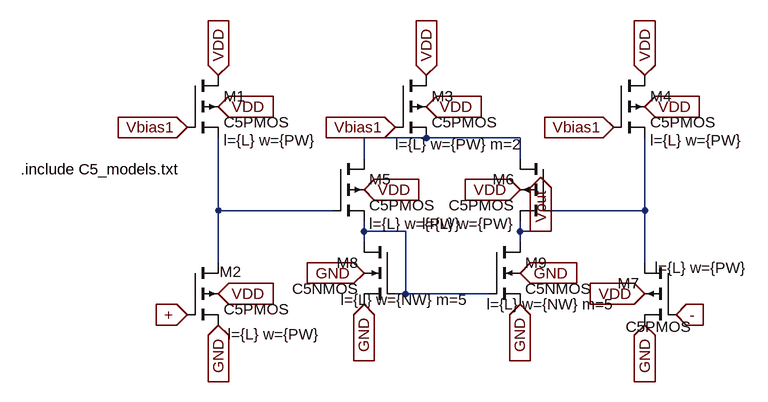
[diagram p0: schematic gainEnhancementPmos.asc]
gainEnhancementPmos.asc, the LTspice schematic file:
Version 4
SHEET 1 880 680
WIRE 304 160 208 160
WIRE 448 160 304 160
WIRE 208 192 208 160
WIRE 448 192 448 160
WIRE -16 272 -16 160
WIRE 160 272 -16 272
WIRE 640 272 640 160
WIRE 640 272 496 272
WIRE 208 304 208 288
WIRE 272 304 208 304
WIRE 448 304 448 288
WIRE 480 304 448 304
WIRE 496 304 480 304
WIRE 208 320 208 304
WIRE 448 320 448 304
WIRE -16 352 -16 272
WIRE 640 352 640 272
WIRE 272 400 272 304
WIRE 272 400 256 400
WIRE 400 400 272 400
FLAG -64 144 Vbias1
IOPIN -64 144 In
FLAG -64 432 +
IOPIN -64 432 In
FLAG 688 432 -
IOPIN 688 432 In
FLAG 480 304 Vout
IOPIN 480 304 Out
FLAG 640 64 VDD
IOPIN 640 64 In
FLAG 640 112 VDD
IOPIN 640 112 In
FLAG 304 112 VDD
IOPIN 304 112 In
FLAG 304 64 VDD
IOPIN 304 64 In
FLAG -16 112 VDD
IOPIN -16 112 In
FLAG -16 64 VDD
IOPIN -16 64 In
FLAG 256 144 Vbias1
IOPIN 256 144 In
FLAG 592 144 Vbias1
IOPIN 592 144 In
FLAG 208 240 VDD
IOPIN 208 240 In
FLAG 448 240 VDD
IOPIN 448 240 In
FLAG -16 448 GND
IOPIN -16 448 In
FLAG 208 416 GND
IOPIN 208 416 In
FLAG 208 368 GND
IOPIN 208 368 In
FLAG 448 416 GND
IOPIN 448 416 In
FLAG 448 368 GND
IOPIN 448 368 In
FLAG 640 448 GND
IOPIN 640 448 In
FLAG -16 400 VDD
IOPIN -16 400 In
FLAG 640 400 VDD
IOPIN 640 400 In
SYMBOL pmos4 -64 64 R0
WINDOW 123 56 100 Left 2
SYMATTR Value2 l={L} w={PW}
SYMATTR InstName M1
SYMATTR Value C5PMOS
SYMBOL pmos4 -64 352 R0
WINDOW 0 50 14 Left 2
WINDOW 123 62 110 Left 2
SYMATTR InstName M2
SYMATTR Value2 l={L} w={PW}
SYMATTR Value C5PMOS
SYMBOL pmos4 256 64 R0
WINDOW 123 0 106 Left 2
SYMATTR Value2 l={L} w={PW} m=2
SYMATTR InstName M3
SYMATTR Value C5PMOS
SYMBOL pmos4 592 64 R0
WINDOW 123 56 100 Left 2
SYMATTR Value2 l={L} w={PW}
SYMATTR InstName M4
SYMATTR Value C5PMOS
SYMBOL pmos4 160 192 R0
WINDOW 123 56 100 Left 2
SYMATTR Value2 l={L} w={PW}
SYMATTR InstName M5
SYMATTR Value C5PMOS
SYMBOL pmos4 496 192 M0
WINDOW 123 56 100 Left 2
SYMATTR Value2 l={L} w={PW}
SYMATTR InstName M6
SYMATTR Value C5PMOS
SYMBOL pmos4 688 352 M0
WINDOW 3 -24 99 Left 2
WINDOW 123 -110 8 Left 2
SYMATTR Value C5PMOS
SYMATTR Value2 l={L} w={PW}
SYMATTR InstName M7
SYMBOL nmos4 256 320 M0
WINDOW 123 -115 89 Left 2
SYMATTR Value2 l={L} w={NW} m=5
SYMATTR InstName M8
SYMATTR Value C5NMOS
SYMBOL nmos4 400 320 R0
WINDOW 123 -3 96 Left 2
SYMATTR Value2 l={L} w={NW} m=5
SYMATTR InstName M9
SYMATTR Value C5NMOS
TEXT -320 208 Left 2 !.include C5_models.txt

The netlist it stands for:
* gainEnhancementPmos.asc
M1 VDD Vbias1 N002 VDD C5PMOS l={L} w={PW}
M2 N002 + GND VDD C5PMOS l={L} w={PW}
M3 VDD Vbias1 N001 VDD C5PMOS l={L} w={PW} m=2
M4 VDD Vbias1 N003 VDD C5PMOS l={L} w={PW}
M5 N001 N002 N004 VDD C5PMOS l={L} w={PW}
M6 N001 N003 Vout VDD C5PMOS l={L} w={PW}
M7 N003 - GND VDD C5PMOS l={L} w={PW}
M8 N004 N004 GND GND C5NMOS l={L} w={NW} m=5
M9 Vout N004 GND GND C5NMOS l={L} w={NW} m=5
.model NMOS NMOS
.model PMOS PMOS
.lib standard.mos
.include C5_models.txt
.backanno
.end